# Altium schematic sheet headers.SchDoc: External Connections
size A4; SheetNumber: 6; SheetTotal: 8
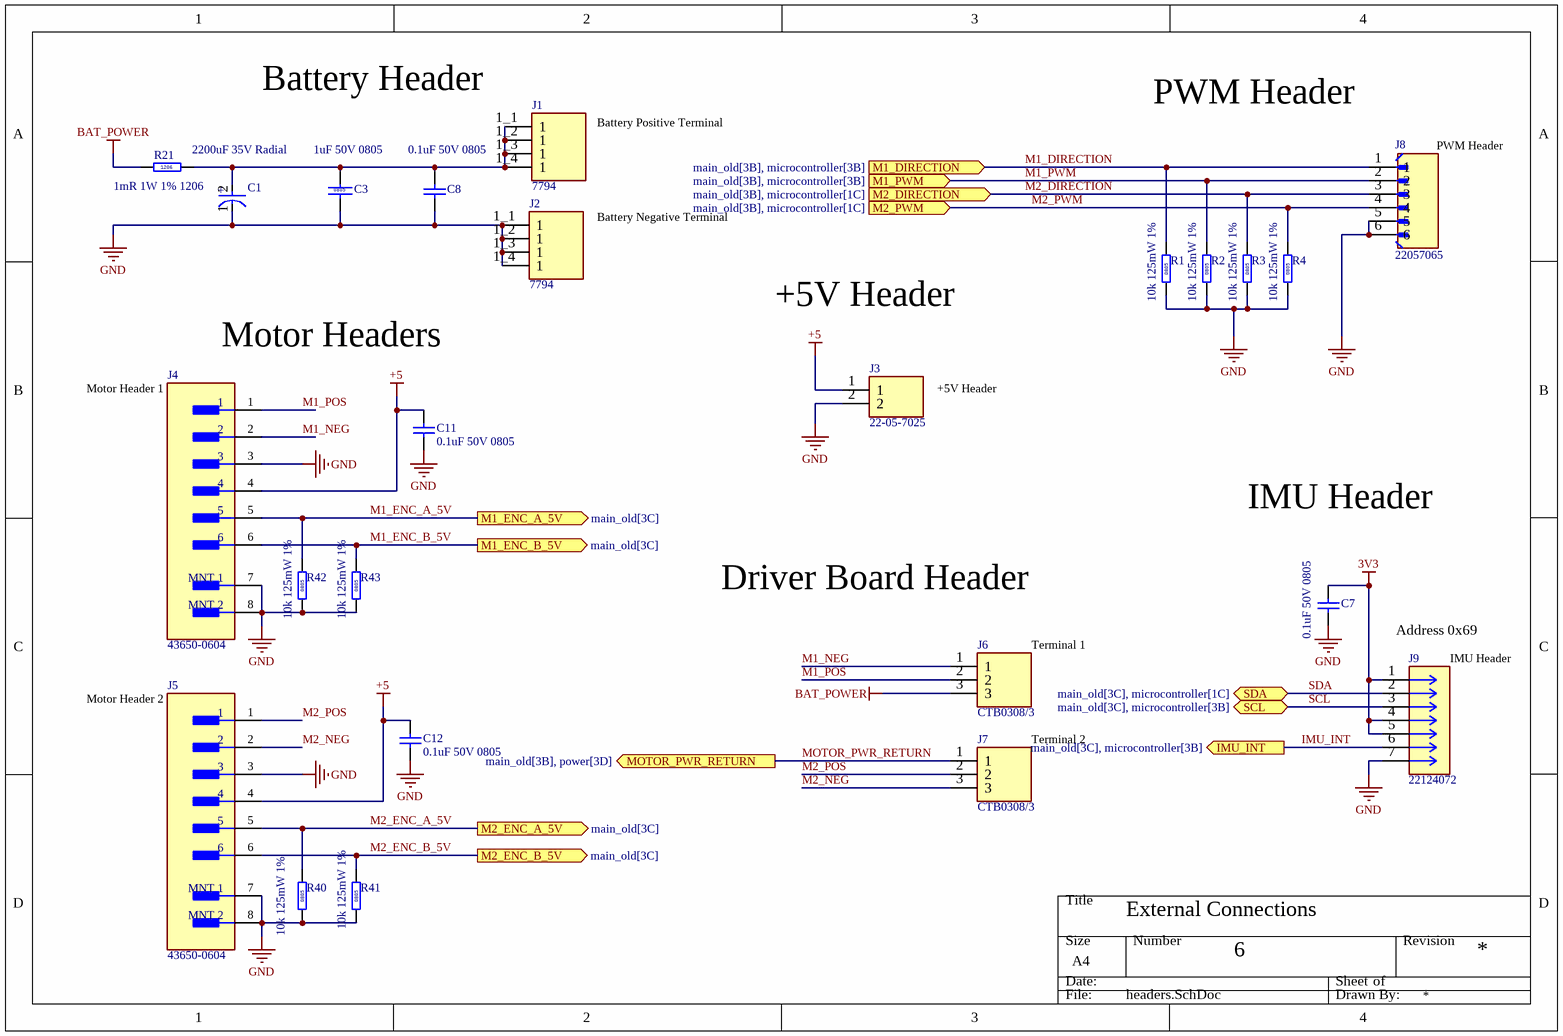
[diagram p0: headers.SchDoc]

## Parts
C1  2200uF 35V Radial  [FP-RAD-TH-D_16_0_5-L_25_2-MFG]
C3  1uF 50V 0805  [CAPC2012X14N]
C7  0.1uF 50V 0805  [CAPC2012X14N]
C8  0.1uF 50V 0805  [CAPC2012X14N]
C11  0.1uF 50V 0805  [CAPC2012X14N]
C12  0.1uF 50V 0805  [CAPC2012X14N]
J1  7794  [KEYSTONE_7794]
J2  7794  [KEYSTONE_7794]
J3  22-05-7025  [MOLEX_22-05-7025]
J4  43650-0604  [FP-43650-0604-MFG]
J5  43650-0604  [FP-43650-0604-MFG]
J6  CTB0308/3  [CTB0308_3-Footprint-1]
J7  CTB0308/3  [CTB0308_3-Footprint-1]
J8  22057065  [MOLEX_22057065]
J9  22124072  [CONN_A-7395-07B_MOL]
R1  10k 125mW 1%  [RESC2013X60X35ML10T20]
R2  10k 125mW 1%  [RESC2013X60X35ML10T20]
R3  10k 125mW 1%  [RESC2013X60X35ML10T20]
R4  10k 125mW 1%  [RESC2013X60X35ML10T20]
R21  1mR 1W 1% 1206  [FP-CSRF1206-IPC_A]
R40  10k 125mW 1%  [RESC2013X60X35ML10T20]
R41  10k 125mW 1%  [RESC2013X60X35ML10T20]
R42  10k 125mW 1%  [RESC2013X60X35ML10T20]
R43  10k 125mW 1%  [RESC2013X60X35ML10T20]

## Ports
IMU_INT (out, see main_old[3C], microcontroller[3B]), M1_DIRECTION (in, see main_old[3B], microcontroller[3B]), M1_ENC_A_5V (out, see main_old[3C]), M1_ENC_B_5V (out, see main_old[3C]), M1_PWM (in, see main_old[3B], microcontroller[3B]), M2_DIRECTION (in, see main_old[3B], microcontroller[1C]), M2_ENC_A_5V (out, see main_old[3C]), M2_ENC_B_5V (out, see main_old[3C]), M2_PWM (in, see main_old[3B], microcontroller[1C]), MOTOR_PWR_RETURN (out, see main_old[3B], power[3D]), SCL (bidir, see main_old[3C], microcontroller[3B]), SDA (bidir, see main_old[3C], microcontroller[1C])

## Nets
3V3: C7.2 J9.1 J9.4 J9.5
+5: C11.2 C12.2 J3.1 J4.4 J5.4
BAT_POWER: J6.3 R21.1
GND: C1.1(C) C3.2 C7.1 C8.1 C11.1 C12.1 J2.1_1(1) J2.1_2(1) J2.1_3(1) J2.1_4(1) J3.2 J4.3 J4.7(MNT_1) J4.8(MNT_2) J5.3 J5.7(MNT_1) J5.8(MNT_2) J8.5 J8.6 J9.7 R1.1 R2.1 R3.1 R4.1 R40.1 R41.1 R42.1 R43.1
IMU_INT: J9.6 ; port IMU_INT
M1_DIRECTION: J8.1 R1.2 ; port M1_DIRECTION
M1_ENC_A_5V: J4.5 R42.2 ; port M1_ENC_A_5V
M1_ENC_B_5V: J4.6 R43.2 ; port M1_ENC_B_5V
M1_NEG: J4.2 J6.1
M1_POS: J4.1 J6.2
M1_PWM: J8.2 R2.2 ; port M1_PWM
M2_DIRECTION: J8.3 R3.2 ; port M2_DIRECTION
M2_ENC_A_5V: J5.5 R40.2 ; port M2_ENC_A_5V
M2_ENC_B_5V: J5.6 R41.2 ; port M2_ENC_B_5V
M2_NEG: J5.2 J7.3
M2_POS: J5.1 J7.2
M2_PWM: J8.4 R4.2 ; port M2_PWM
MOTOR_PWR_RETURN: J7.1 ; port MOTOR_PWR_RETURN
SCL: J9.3 ; port SCL
SDA: J9.2 ; port SDA
NetC1_2: C1.2(A) C3.1 C8.2 J1.1_1(1) J1.1_2(1) J1.1_3(1) J1.1_4(1) R21.2

## Notes on the sheet
- (near J1) Battery Header
- PWM Header
- Battery Positive Terminal
- (near J8) PWM Header
- Battery Negative Terminal
- +5V Header
- Motor Headers
- Motor Header 1
- IMU Header
- Driver Board Header
- Terminal 1
- (near J9) Address 0x69
- Motor Header 2
- (near J9) IMU Header
- Terminal 2
- Sheet Title
- Design Title
- Sheet
- SIZE
- C
- Designer
- PCB Code
- PCB Rev
- Approver
- Assembly Code
- Issue
- EC No.
- Approved Date
- (in symbol CMP-05427-000859-1) +

## Library data of the parts
C1 = CMP-05427-000859-1: Aluminum Electrolytic Capacitors (Radial Lead Type) 2200uF ±20% 35V
C3 = CMP-40-005-00008-4: Cap, SMD, 1uF, 50V, 10%, 0805, X7R; ManufacturerPartNumber: CL21B105KBFNNN; Manufacturer: Samsung Electro Mechanics; CapacitorType: Ceramic; Value: 1µF; ComponentLinkDescription: Datasheet; VoltageRating: 50V; MountingType: SMD; Package: 0805; ComponentLinkURL: http://weblib.samsungsem.com/mlcc/mlcc-ec-data-sheet.do?partNumber=CL21B105KBFNNN; Tolerance: 10%; DielectricType: X7R
C7 C8 C11 C12 = CMP-40-005-00117-1: Cap, SMD, 0.1uF, 50V, 10%, 0805, X7R; Manufacturer: Samsung; ManufacturerPartNumber: CL21B104KBCWPNC; CapacitorType: Ceramic; Value: 100nF; ComponentLinkDescription: Datasheet; Package: 0805; MountingType: SMD; VoltageRating: 50V; Tolerance: 10%; ComponentLinkURL: https://octopart.com/part/samsung-electro-mechanics/CL21B104KBCWPNC; DielectricType: Ceramic
J1 J2 = 7794: PC SCREW TERMINAL | Keystone Electronics 7794; SnapEDA_Link: https://www.snapeda.com/parts/7794/Keystone/view-part/?ref=snap; Package: None; Value: *; MF: Keystone Electronics; MP: 7794; Check_prices: https://www.snapeda.com/parts/7794/Keystone/view-part/?ref=eda
J3 = 22-05-7025: Header 2.5mm SPOX, WTB, RA, F/lock, 2w | Molex Incorporated 22-05-7025; SnapEDA_Link: https://www.snapeda.com/parts/22-05-7025/Molex/view-part/?ref=snap; Package: None; Value: *; MF: Molex; MP: 22-05-7025; Check_prices: https://www.snapeda.com/parts/22-05-7025/Molex/view-part/?ref=eda
J4 J5 = CMP-00257-00298091-1: 43650-0604 Conn Power HDR 6 POS 3mm Solder RA Thru-Hole 6 Terminal 1 Port Micro-Fit 3.0™ Frame; Manufacturer Lifecycle Status: ACTIVE; NexarPartId: 298091; Gender: Male; Number of Contacts: 6; Current Rating: 5A; Plating: Tin; Glow Wire Compliant: Compliant; Voltage Rating: 600V; Connector Type: Male Pin; Contact Material: Brass; Color: Black; Housing Material: Plastic; Contact Gender: Male; Halogen Free: Low Halogen; Min Operating Temperature: -40°C; Pitch: 3mm; Housing Color: Black; Lifecycle Status: Production; Termination: Solder; Width: 9.9mm; Orientation: Right Angle; Length: 21.6mm; Lead Free: Contains Lead; Number of Pins: 6; Max Operating Temperature: 105°C; Number of Positions: 6; Number of Rows: 1; RoHS: Compliant; Number of Circuits: 6; Country of Origin: US; Mount: Through Hole; Contact Plating: Gold; Schedule B: 8536694040; Fastening Type: Ramp; Height: 4.37mm
J6 J7 = CMP-40-050-00115-1: Barrier Strip Terminal Block, 3 position; ManufacturerPartNumber: CTB0308_3; Manufacturer: CAMDENBOSS; VoltageRating: 130V; Number of Ways: 3; ComponentLinkDescription: Datasheet; Current Rating: 10A; Jack/Receptacle: Receptacle; ComponentLinkURL: https://datasheet.ciiva.com/pdfs/VipMasterIC/IC/CAME/CAMES00005/CAMES00005-1.pdf?src-supplier=IHS+Markit; Minimum Operating Temperature: 0°C; REACHStatement: No; Number of Rows: 1; Terminal and Terminal Block Type: BARRIER STRIP TERMINAL BLOCK; Manufacturer Series: CTB0308; RoHS3Compliant: Yes; MountingType: TH; RoHS3Certificate: Yes; ConnectorType: Terminal Block; Maximum Operating Temperature: 110°C
J8 = 22057065: Conn Shrouded Header (4 Sides) HDR 6 POS 2.5mm Solder RA Side Entry Thru-Hole SPOXâ„¢ Bag; MF: Molex; SnapEDA_Link: https://www.snapeda.com/parts/22057065/Molex/view-part/?ref=snap; Package: None; Value: *; MP: 22057065; Check_prices: https://www.snapeda.com/parts/22057065/Molex/view-part/?ref=eda
R1-R4 R40-R43 = CMP-40-025-00226-1: Res, SMD, 10k, 125mW, 1%, ±200ppm, 0805; Manufacturer: Panasonic; ManufacturerPartNumber: ERJ-6GEYJ103V; Package Height: 0.6mm; ComponentLinkDescription: Datasheet; Voltage Rating: 150V; Tolerance: 5%; RoHS3Certificate: https://download.siliconexpert.com/pdfs2/2024/6/2/9/59/48/925943/pns_/manual/erj6enf2700v_rohs.pdf; Composition: Thick Film; Contact Plating: Tin; Reach SVHC Compliant: Unaffected; ComponentLinkURL: https://octopart.com/erj-6geyj103v-panasonic-55422885; Temperature Coefficient (ppm/cel): ±200ppm; Resistance: 10k; Max Operating Temperature: 155°C; Mount: SMD; Number of Pins: 2; Case/Package: 0805; RoHS3Compliant: Yes (with exeption); Power Rating: 125mW; Resistor Type: Fixed; Min Operating Temperature: -55°C
R21 = CMP-40-025-00210-2: Res, SMD, 1mR, 1W, 0.0316V, 1% +/-Tol, 50ppm/Cel, 1206; ManufacturerPartNumber: CRF1206-FZ-R001ELF; Manufacturer: Bourns; ComponentLinkDescription: Datasheet; Value: 1m; ComponentLinkURL: https://datasheet.octopart.com/CRF1206-FZ-R001ELF-Bourns-datasheet-176301116.pdf?src-supplier=Electro+Sonic; Mount: SMD; MountingType: SMD; Package: 1206; Tolerance: 1%; PowerRating: 1W
J9 = 22124072: Package: None; Price: None; Value: *; MP: 22124072; Availability: Unavailable